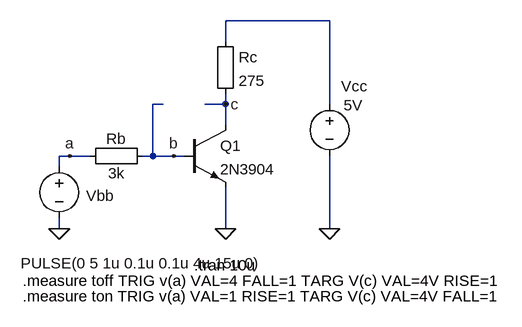
[diagram p0: schematic BT-CE-SWITCH-TOFF.asc]
BT-CE-SWITCH-TOFF.asc, the LTspice schematic file:
Version 4
SHEET 1 880 680
WIRE 432 -112 272 -112
WIRE 272 -80 272 -112
WIRE 176 16 160 16
WIRE 272 16 272 0
WIRE 272 16 240 16
WIRE 432 16 432 -112
WIRE 272 48 272 16
WIRE 32 96 16 96
WIRE 64 96 32 96
WIRE 160 96 160 16
WIRE 160 96 144 96
WIRE 192 96 160 96
WIRE 208 96 192 96
WIRE 16 112 16 96
WIRE 16 208 16 192
WIRE 272 208 272 144
WIRE 432 208 432 96
FLAG 272 208 0
FLAG 16 208 0
FLAG 432 208 0
FLAG 192 96 b
FLAG 272 16 c
FLAG 32 96 a
SYMBOL Misc\\EuropeanResistor 256 -96 R0
SYMATTR InstName Rc
SYMATTR Value 275
SYMBOL Misc\\EuropeanResistor 160 80 R90
WINDOW 0 5 56 VBottom 2
WINDOW 3 27 56 VTop 2
SYMATTR InstName Rb
SYMATTR Value 3k
SYMBOL voltage 16 96 R0
WINDOW 3 -59 165 Left 2
WINDOW 123 0 0 Left 2
WINDOW 39 0 0 Left 2
WINDOW 0 42 61 Left 2
SYMATTR Value PULSE(0 5 1u 0.1u 0.1u 4u 15u 0)
SYMATTR InstName Vbb
SYMBOL voltage 432 0 R0
WINDOW 3 22 18 Left 2
WINDOW 123 0 0 Left 2
WINDOW 39 0 0 Left 2
WINDOW 0 18 -11 Left 2
SYMATTR Value 5V
SYMATTR InstName Vcc
SYMBOL npn 208 48 R0
SYMATTR InstName Q1
SYMATTR Value 2N3904
TEXT 224 264 Left 2 !.tran 10u
TEXT -40 288 Left 2 !.measure toff TRIG v(a) VAL=4 FALL=1 TARG V(c) VAL=4V RISE=1
TEXT -40 312 Left 2 !.measure ton TRIG v(a) VAL=1 RISE=1 TARG V(c) VAL=4V FALL=1

The netlist it stands for:
* BT-CE-SWITCH-TOFF.asc
Rc N001 c 275
Rb b a 3k
Vbb a 0 PULSE(0 5 1u 0.1u 0.1u 4u 15u 0)
Vcc N001 0 5V
Q1 c b 0 0 2N3904
.model NPN NPN
.model PNP PNP
.lib standard.bjt
.tran 10u
.measure toff TRIG v(a) VAL=4 FALL=1 TARG V(c) VAL=4V RISE=1
.measure ton TRIG v(a) VAL=1 RISE=1 TARG V(c) VAL=4V FALL=1
.backanno
.end